# EAGLE design spotmicroservo (EAGLE 9.6.2)
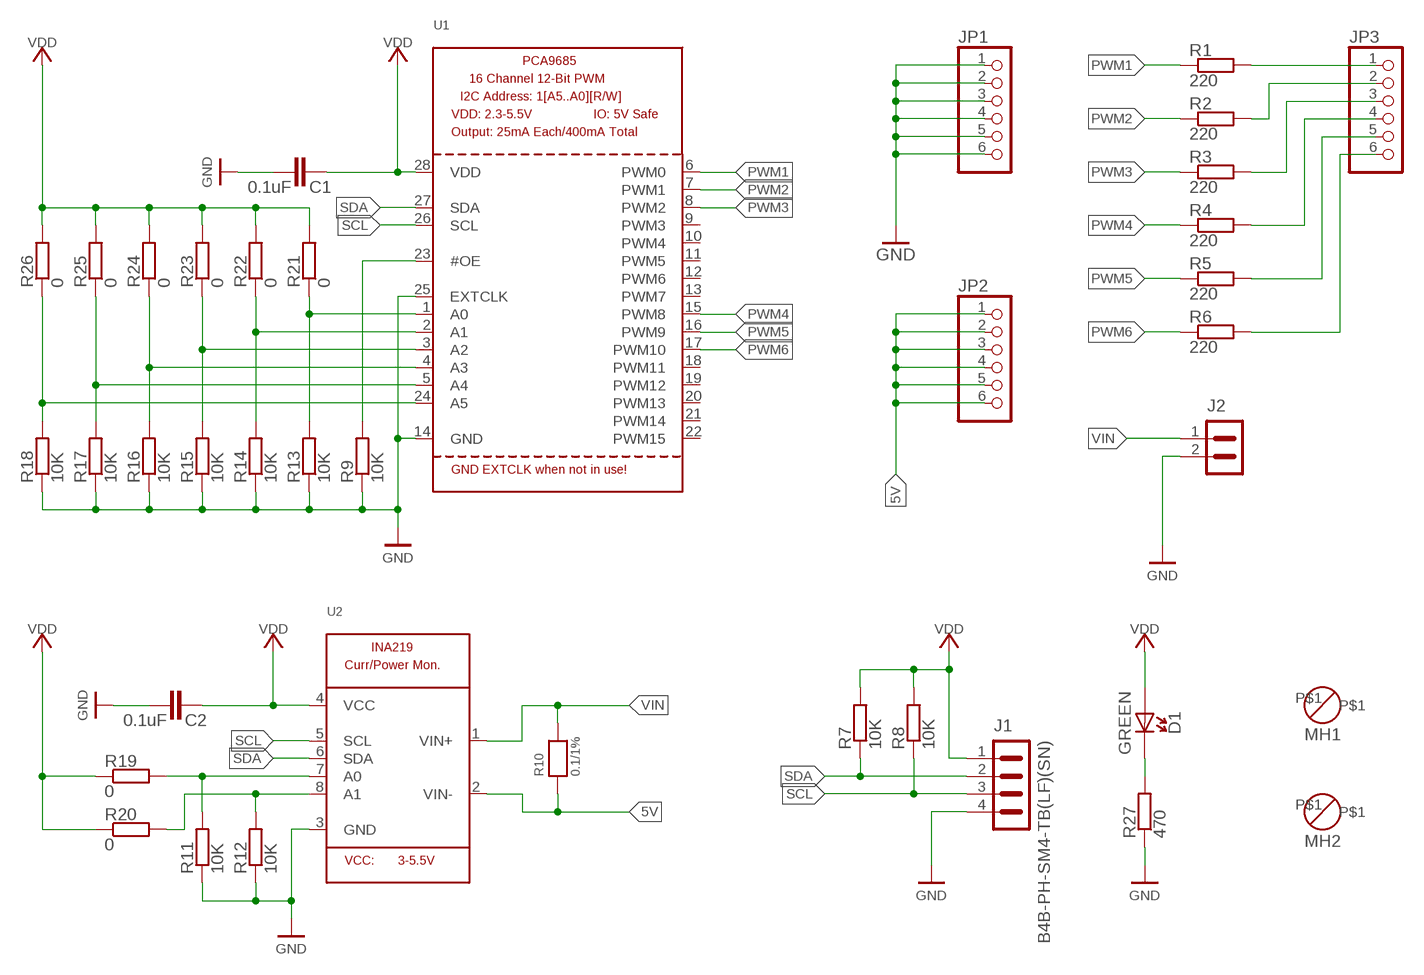
[diagram p0: schematic, sheet 1]

## Parts
C1  0.1uF  CAPACITOR_NPOL-0402  [C0402]
C2  0.1uF  CAPACITOR_NPOL-0402  [C0402]
D1  GREEN  LED_SINGLE-0402  [D0402]
J1  B4B-PH-SM4-TB(LF)(SN)  CON_HEADER_1X04_JST_B4B-PH-SM4-TB(LF)(SN)  [CON_JST_B4B-PH-SM4-TB(LF)(SN)]
J2  CON_HEADER_1X02-B2B-XH-A(LF)(SN)  [JST_B2B-XH-A(LF)(SN)]
JP1  PINHD-1X6B  [1X06-BIG]
JP2  PINHD-1X6B  [1X06-BIG]
JP3  PINHD-1X6B  [1X06-BIG]
MH1  MOUNT-HOLE2.6MM  [MOUNT-HOLE2.6]
MH2  MOUNT-HOLE2.6MM  [MOUNT-HOLE2.6]
R1  220  RESISTOR-0402  [R0402]
R2  220  RESISTOR-0402  [R0402]
R3  220  RESISTOR-0402  [R0402]
R4  220  RESISTOR-0402  [R0402]
R5  220  RESISTOR-0402  [R0402]
R6  220  RESISTOR-0402  [R0402]
R7  10K  RESISTOR-0402  [R0402]
R8  10K  RESISTOR-0402  [R0402]
R9  10K  RESISTOR-0402  [R0402]
R10  0.1/1%  MICROBUILDER_RESISTOR2512  [MICROBUILDER_2512]
R11  10K  RESISTOR-0402  [R0402]
R12  10K  RESISTOR-0402  [R0402]
R13  10K  RESISTOR-0402  [R0402]
R14  10K  RESISTOR-0402  [R0402]
R15  10K  RESISTOR-0402  [R0402]
R16  10K  RESISTOR-0402  [R0402]
R17  10K  RESISTOR-0402  [R0402]
R18  10K  RESISTOR-0402  [R0402]
R19  0  RESISTOR-0402  [R0402]
R20  0  RESISTOR-0402  [R0402]
R21  0  RESISTOR-0402  [R0402]
R22  0  RESISTOR-0402  [R0402]
R23  0  RESISTOR-0402  [R0402]
R24  0  RESISTOR-0402  [R0402]
R25  0  RESISTOR-0402  [R0402]
R26  0  RESISTOR-0402  [R0402]
R27  470  RESISTOR-0402  [R0402]
U1  PCA9685  [TSSOP28]
U2  MICROBUILDER_INA219  [MICROBUILDER_SOT23-8]

## Nets
5V: JP2.1 JP2.2 JP2.3 JP2.4 JP2.5 JP2.6 R10.1 U2.2(VIN-)
GND: C1.1 C2.1 J1.4 J2.2 JP1.1 JP1.2 JP1.3 JP1.4 JP1.5 JP1.6 R9.1 R11.1 R12.1 R13.1 R14.1 R15.1 R16.1 R17.1 R18.1 R27.1 U1.14(GND) U1.25(EXTCLK) U2.3(GND)
N$1: JP3.1 R1.2
N$2: R9.2 U1.23(#OE)
N$3: JP3.2 R2.2
N$4: JP3.3 R3.2
N$5: JP3.4 R4.2
N$6: JP3.5 R5.2
N$7: JP3.6 R6.2
N$8: R11.2 R19.2 U2.7(A0)
N$9: R12.2 R20.2 U2.8(A1)
N$10: R13.2 R21.1 U1.1(A0)
N$11: R14.2 R22.1 U1.2(A1)
N$12: R15.2 R23.1 U1.3(A2)
N$13: R16.2 R24.1 U1.4(A3)
N$14: R17.2 R25.1 U1.5(A4)
N$15: R18.2 R26.1 U1.24(A5)
N$16: D1.2(C) R27.2
PWM1: R1.1 U1.6(PWM0)
PWM2: R2.1 U1.7(PWM1)
PWM3: R3.1 U1.8(PWM2)
PWM4: R4.1 U1.15(PWM8)
PWM5: R5.1 U1.16(PWM9)
PWM6: R6.1 U1.17(PWM10)
SCL: J1.3 R8.1 U1.26(SCL) U2.5(SCL)
SDA: J1.2 R7.1 U1.27(SDA) U2.6(SDA)
VDD: C1.2 C2.2 D1.1(A) J1.1 R7.2 R8.2 R19.1 R20.1 R21.2 R22.2 R23.2 R24.2 R25.2 R26.2 U1.28(VDD) U2.4(VCC)
VIN: J2.1 R10.2 U2.1(VIN+)
Unconnected: MH1.P$1 MH2.P$1 U1.9(PWM3) U1.10(PWM4) U1.11(PWM5) U1.12(PWM6) U1.13(PWM7) U1.18(PWM11) U1.19(PWM12) U1.20(PWM13) U1.21(PWM14) U1.22(PWM15)

## Library data of the parts
C1 C2 = carro:CAPACITOR_NPOL: Non-Polarized capacitor in various packages
D1 = carro:LED_SINGLE
J1 = carro:CON_HEADER_1X04
J2 = carro:CON_HEADER_1X02
JP1-JP3 = adafruit:PINHD-1X6: PIN HEADER
MH1 MH2 = carro:MOUNT-HOLE; BOM: EXCLUDE
R1-R9 R11-R27 = carro:RESISTOR: Resistor in various packages
R10 = Adafruit_INA219_CurPowerMonitor:MICROBUILDER_RESISTOR: Resistors 0402 - 0402 Surface Mount Package 22 Ohm 1% 1/16W [Digikey: 311-22.0LRTR-ND] 33 Ohm 5% 1/16W 1.0K 5% 1/16W 1.5K 5% 1/16W 2.0K 1% 1/16W 10.0K 1% 1/16W [Digikey: 311-10.0KLRTR-ND] 10.0K 5% 1/16W [Digikey: RMCF0402JT10K0TR-ND] 12.1K 1% 1/16W [Digikey: 311-22.0LRTR-ND] 100.0K 5% 1/16W 0603 - 0603 Surface Mount Package 0 Ohm 1/10 Watt 1% Resistor 15 Ohm 1/10 Watt 1% Resistor 33 Ohm 1/10 Watt 1% Resistor 49.9 Ohm 1/10 Watt 1% Resistor 100 Ohm 1/10 Watt 1% Resistor 150 Ohm 1/10 Watt 1% Resistor 240 Ohm 1/10 Watt 1% Resistor 390 Ohm 1/10 Watt 1% Resistor 560 Ohm 1/10 Watt 1% Resistor 680 Ohm 1/10 Watt 1% Resistor 750 Ohm 1/10 Watt 1% Resistor 1.0K Ohm 1/10 Watt 1% Resistor 1.5K Ohm 1/10 Watt 1% Resistor 2.0K Ohm 1/10 Watt 1% Resistor 2.2K Ohm 1/10 Watt 1% Resistor 3.3K Ohm 1/10 Watt 1% Resistor 4.7K Ohm 1/10 Watt 1% Resistor 10.0K Ohm 1/10 Watt 1% Resistor 12.0K Ohm 1/10 Watt 1% Resistor 12.1K Ohm 1/10 Watt 1% Resistor 20.0K Ohm 1/10 Watt 1% Resistor 33.0K Ohm 1/10 Watt 1% Resistor 100.0K Ohm 1/10 Watt 1% Resistor 0805 - 0805 Surface Mount Package 0 Ohm 1/8 Watt 1% Resistor 33 Ohm 1/8 Watt 1% Resistor 100 Ohm 1/8 Watt 1% Resistor 150 Ohm 1/8 Watt 1% Resistor 200 Ohm 1/8 Watt 1% Resistor 240 Ohm 1/8 Watt 1% Resistor 330 Ohm 1/8 Watt 1% Resistor 390 Ohm 1/8 Watt 1% Resistor 470 Ohm 1/8 Watt 1% Resistor 1.0K Ohm 1/8 Watt 1% Resistor 1.5K Ohm 1/8 Watt 1% Resistor 2.0K Ohm 1/8 Watt 1% Resistor 4.7K Ohm 1/8 Watt 1% Resistor 5.1K Ohm 1/8 Watt 1% Resistor 5.6K Ohm 1/8 Watt 1% Resistor 10.0K Ohm 1/8 Watt 1% Resistor 22.0K Ohm 1/8 Watt 1% Resistor 33.0K Ohm 1/8 Watt 1% Resistor 100K Ohm 1/8 Watt 1% Resistor 1206 - 1206 Surface Mount Package 2012 - 2010 Surface Mount Package 0.11 Ohm 1/2 Watt 1% Resistor - Digikey: RHM.11UCT-ND
U1 = adafruit:PCA9685: PCA9685 - 16 Channel 12-Bit I2C PWM Controller 5.0V tolerant 16 channel, 12-bit I2C PWM controller with 25mA per output (max. 400mA total) Digikey: 568-5931-1-ND
U2 = Adafruit_INA219_CurPowerMonitor:MICROBUILDER_INA219: INA219 - I2C Current/Power Monitor Voltage Range: 0-26V Accuracy: 0.5% Temperature: -40°C - 125°C

## Board
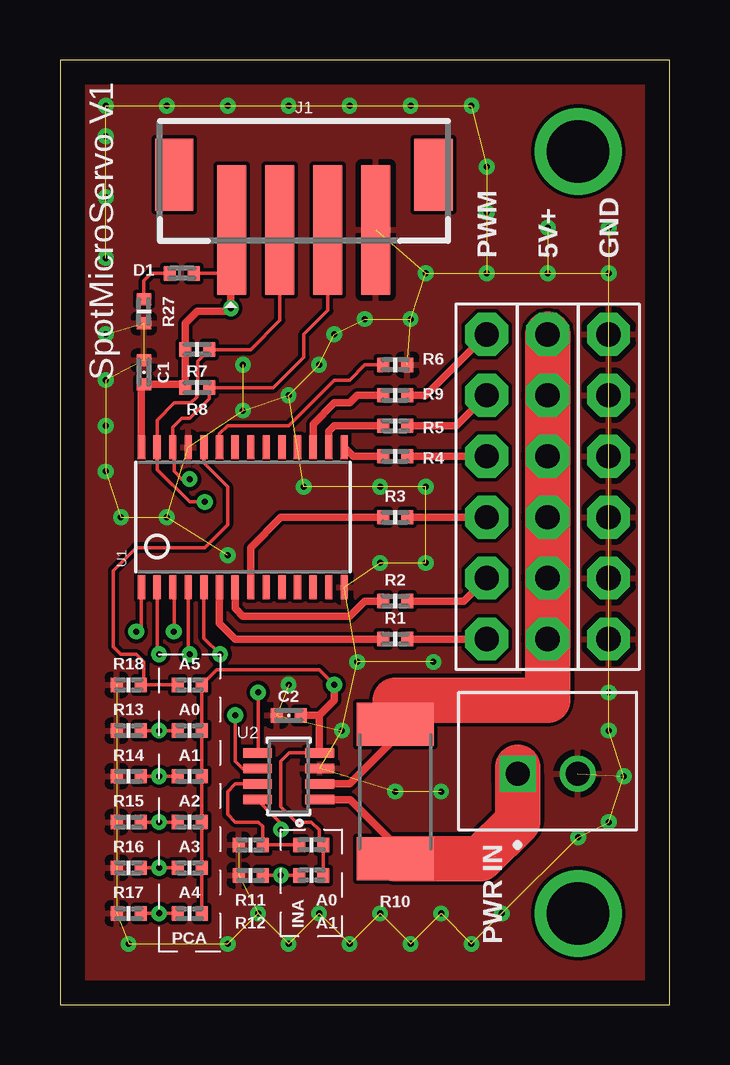
[diagram p1: board, top side]
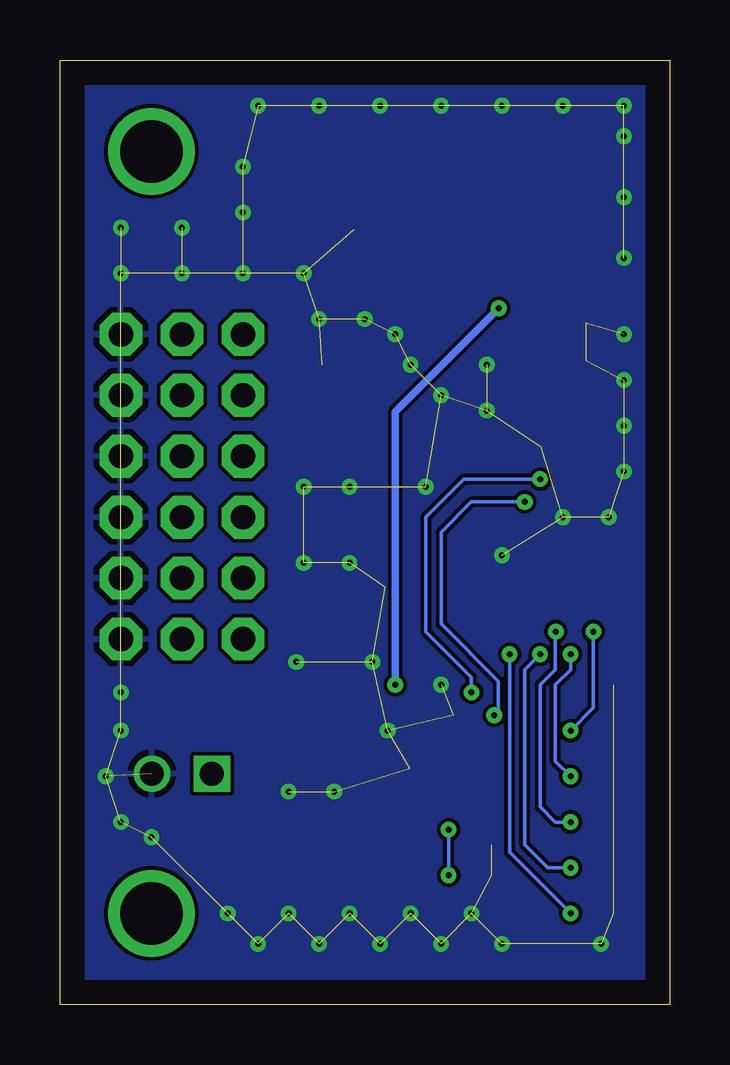
[diagram p2: board, bottom side, seen from below]

Size 25.4 x 39.37 mm. Coordinates in mm from the lower left corner, seen from the top.
Outline: 0,0 25.4,0 25.4,39.37 0,39.37 0,0
Copper layers (1*16): Top 0.035mm / dielectric 1.5mm / Bottom 0.035mm
Design rules "default": minimum track width 6mil, minimum drill 0.35mm, track to track 6mil, track to pad 6mil, pad to pad 6mil, via to via 6mil, smd to smd 6mil, copper to edge 40mil, drill to drill 6mil, minimum pad ring 10mil, minimum via ring 8mil, stop-mask expansion 4mil, vias tented up to drill 0mil, thermal gap 10mil

### Footprints (pad centres in the part's own frame; a part is rotated, then mirrored left to right if it is on the bottom)
C0402 = smd 0.5 x 0.6: 1 -0.5,0; 2 0.5,0
D0402 = smd 0.5 x 0.6: 1 -0.5,0; 2 0.5,0
CON_JST_B4B-PH-SM4-TB(LF)(SN) = smd 1.2 x 5.4: 1 -3,-1.05; 2 -1,-1.05; 3 1,-1.05; 4 3,-1.05 | smd 1.6 x 3: NC@1 -5.4,1.25; NC@2 5.4,1.25
JST_B2B-XH-A(LF)(SN) = drill 1 square: 1 -1.25,-0.525 | drill 1: 2 1.25,-0.525
1X06-BIG = drill 1.016 pad 1.778 octagon: 1 -6.35,0; 2 -3.81,0; 3 -1.27,0; 4 1.27,0; 5 3.81,0; 6 6.35,0
MOUNT-HOLE2.6 = drill 2.6 pad 3.6: P$1 0,0
R0402 = smd 0.5 x 0.6: 1 -0.5,0; 2 0.5,0
MICROBUILDER_2512 = smd 1.8 x 3.2: 1 -2.8,0; 2 2.8,0
TSSOP28 = smd 0.305 x 0.991: 1 -4.225,-2.918; 2 -3.575,-2.918; 3 -2.925,-2.918; 4 -2.275,-2.918; 5 -1.625,-2.918; 6 -0.975,-2.918; 7 -0.325,-2.918; 8 0.325,-2.918; 9 0.975,-2.918; 10 1.625,-2.918; 11 2.275,-2.918; 12 2.925,-2.918; 13 3.575,-2.918; 14 4.225,-2.918; 15 4.225,2.918; 16 3.575,2.918; 17 2.925,2.918; 18 2.275,2.918; 19 1.625,2.918; 20 0.975,2.918; 21 0.325,2.918; 22 -0.325,2.918; 23 -0.975,2.918; 24 -1.625,2.918; 25 -2.275,2.918; 26 -2.925,2.918; 27 -3.575,2.918; 28 -4.225,2.918
MICROBUILDER_SOT23-8 = smd 0.4 x 1.2: 1 -0.975,-1.3; 2 -0.325,-1.3; 3 0.325,-1.3; 4 0.975,-1.3; 5 0.975,1.3; 6 0.325,1.3; 7 -0.325,1.3; 8 -0.975,1.3

### Placement (x,y rotation side)
C1  3.49,26.35 270 top
C2  9.53,12.06 0 top
D1  5.08,30.48 180 top
J1  10.16,33.34 0 top
J2  20.32,10.16 0 top
JP1  22.86,21.59 90 top
JP2  20.32,21.59 90 top
JP3  17.78,21.59 90 top
MH1  21.59,3.81 0 top
MH2  21.59,35.56 0 top
R1  13.97,15.24 0 top
R2  13.97,16.83 0 top
R3  13.97,20.32 0 top
R4  13.97,22.86 0 top
R5  13.97,24.13 0 top
R6  13.97,25.4 0 top
R7  5.72,27.3 180 top
R8  5.72,25.72 180 top
R9  13.97,26.67 180 top
R10  13.97,8.89 270 top
R11  7.94,6.67 0 top
R12  7.94,5.4 0 top
R13  2.86,11.43 0 top
R14  2.86,9.52 0 top
R15  2.86,7.62 0 top
R16  2.86,5.71 0 top
R17  2.86,3.81 0 top
R18  2.86,13.34 0 top
R19  10.48,6.67 180 top
R20  10.48,5.4 180 top
R21  5.4,11.43 0 top
R22  5.4,9.52 0 top
R23  5.4,7.62 0 top
R24  5.4,5.71 0 top
R25  5.4,3.81 0 top
R26  5.4,13.34 0 top
R27  3.49,28.89 90 top
U1  7.62,20.32 0 top
U2  9.53,9.52 90 top

### Tracks (layer width: path | path; a pad name or v marks a point on that pad's centre or on a via)
5V
  Top 0.305: U2.2 10.83,9.21 12.07,9.21 13.97,11.11 R10.1
  Top 0.61: 13.97,12.7 R10.1
  Top 1.905: JP2.6 JP2.5 JP2.4 JP2.3 JP2.2 JP2.1 20.32,12.7 13.97,12.7
GND  (via drill 0.25)  (81 unrouted)
  other vias: 4.45,20.32 2.54,20.32 1.91,22.23 1.91,24.13 7.62,24.77 9.53,25.4 10.8,26.67 7.62,26.67 11.43,27.94 12.7,28.58 14.61,28.58 15.24,30.48 17.78,30.48 20.32,30.48 22.86,30.48 10.16,21.59 13.34,21.59 15.24,21.59 13.34,18.41 15.24,18.41 13.97,8.89 15.88,8.89 22.86,11.43 23.5,9.52 22.86,7.62 18.42,3.81 15.88,3.81 13.34,3.81 10.8,3.81 8.26,3.81 1.91,26.03 1.91,27.94 1.91,31.11 1.91,33.66 1.91,36.19 1.91,37.47 4.45,37.47 6.99,37.47 9.53,37.47 12.07,37.47 14.61,37.47 17.15,37.47 17.78,34.92 17.78,33.02 20.32,32.39 22.86,32.39 17.15,2.54 14.61,2.54 12.07,2.54 9.53,2.54 6.99,2.54 2.86,2.54 12.38,14.29 15.56,14.29 21.59,6.98 6.99,18.73 22.86,13.02 9.53,13.34 11.75,11.43
  pour Top: -2.54,41.91 27.94,41.91 27.94,-2.54 -2.54,-2.54
  pour Bottom: -5.08,44.45 30.48,44.45 30.48,-5.08 -5.08,-5.08
N$1
  Top 0.305: R1.2 JP3.1
N$2
  Top 0.152: U1.23 6.65,23.79 6.99,24.13 9.53,24.13 11.43,26.03 12.07,26.03 12.7,26.67 R9.2
N$3
  Top 0.305: JP3.2 16.83,16.83 R2.2
N$4
  Top 0.305: R3.2 JP3.3
N$5
  Top 0.305: R4.2 JP3.4
N$6
  Top 0.305: R5.2 16.51,24.13 JP3.5
N$7
  Top 0.305: JP3.6 15.24,25.4 R6.2
N$8
  Top 0.152: R19.2 R11.2 8.44,7.44 8.26,7.62 7.3,7.62 6.99,7.94 6.99,8.89 7.3,9.21 8.22,9.21 U2.7
N$9  (via drill 0.25)
  Top 0.152: R20.2 v9.21,5.4 R12.2 | v9.21,7.3 9.21,7.57 U2.8
  Bottom 0.152: v9.21,5.4 v9.21,7.3
N$10  (via drill 0.25)
  Top 0.152: R13.2 v4.13,11.43 R21.1 | v3.18,15.56 3.4,15.78 U1.1
  Bottom 0.152: v4.13,11.43 3.18,12.38 v3.18,15.56
N$11  (via drill 0.25)
  Top 0.152: R14.2 v4.13,9.52 R22.1 | U1.2 4.05,14.69 v4.13,14.6
  Bottom 0.152: v4.13,9.52 4.76,10.16 4.76,13.34 4.13,13.97 v4.13,14.6
N$12  (via drill 0.25)
  Top 0.152: R15.2 v4.13,7.62 R23.1 | U1.3 4.76,17.34 4.76,15.56 v4.74,15.56
  Bottom 0.152: v4.13,7.62 4.76,7.62 5.4,8.26 5.4,13.34 4.76,13.97 4.76,15.53 v4.74,15.56
N$13  (via drill 0.25)
  Top 0.152: R16.2 v4.13,5.71 R24.1 | v5.4,14.6 5.35,14.66 U1.4
  Bottom 0.152: v4.13,5.71 5.08,5.71 6.03,6.67 6.03,13.97 v5.4,14.6
N$14  (via drill 0.25)
  Top 0.152: R17.2 v4.13,3.81 R25.1 | v6.67,14.6 6,15.28 U1.5
  Bottom 0.152: v4.13,3.81 6.67,6.35 v6.67,14.6
N$15
  Top 0.152: R18.2 3.49,13.34 | 3.49,13.34 R26.1 | U1.24 6,22.58 6.99,21.59 6.99,20 6.03,19.05 3.18,19.05 2.22,18.1 2.22,14.92 2.54,14.6 3.18,14.6 3.49,14.29 3.49,13.34
N$16
  Top 0.152: D1.2 3.81,30.48 3.49,30.16 R27.2
PWM1
  Top 0.305: R1.1 7.3,15.24 6.65,15.9 U1.6
PWM2
  Top 0.305: U1.7 7.3,16.52 7.62,16.19 12.07,16.19 12.7,16.83 R2.1
PWM3
  Top 0.305: R3.1 9.21,20.32 7.94,19.05 7.94,17.41 U1.8
PWM4
  Top 0.305: R4.1 12.22,22.86 U1.15
PWM5
  Top 0.305: U1.16 11.2,23.89 11.43,24.13 R5.1
PWM6
  Top 0.305: R6.1 12.38,25.4 12.07,25.08 11.43,25.08 10.55,24.2 U1.17
SCL  (via drill 0.25)
  Top 0.152: J1.3 11.16,28.94 10.16,27.94 10.16,26.99 8.89,25.72 R8.1 6.22,25.27 5.4,24.45 5.08,24.45 4.7,24.06 U1.26 4.76,23.17 4.76,22.23 5.08,21.91 v5.4,21.91 | v8.26,13.02 8.26,10.53 U2.5
  Bottom 0.152: v5.4,21.91 8.57,21.91 10.16,20.32 10.16,15.56 8.26,13.65 v8.26,13.02
SDA  (via drill 0.25)
  Top 0.152: U1.27 4.05,24.36 4.76,25.08 5.45,25.08 5.69,25.32 5.69,25.38 5.74,25.42 5.74,26.83 R7.1 7.94,27.3 9.16,28.53 J1.2 | U1.27 4.13,23.16 | U2.6 8.22,9.84 7.62,9.84 7.3,10.16 v7.3,12.06 | v6.03,20.95 5.4,20.95 4.05,22.31 U1.27
  Bottom 0.152: v6.03,20.95 8.26,20.95 9.53,19.69 9.53,15.88 7.14,13.49 7.14,12.22 v7.3,12.06
VDD  (via drill 0.25)
  Top 0.152: R20.1 R19.1 | R19.1 10.98,6.8 | R25.2 R24.2 R23.2 R22.2 R21.2 R26.2 6.53,13.97 10.8,13.97 v11.43,13.34 | R19.1 10.8,6.85 10.8,7.3 10.48,7.62 9.84,7.62 9.21,8.26 9.21,10.16 9.55,10.5 U2.4 | D1.1 7.12,30.48
  Top 0.305: J1.1 7.16,30.66 7.12,30.61 7.12,30.48 v7.12,29.03 6.99,28.89 5.72,28.89 5.22,28.39 R7.2 R8.2 5.08,25.85 C1.2 3.4,25.75 U1.28 | v11.43,13.34 11.43,12.7 10.8,12.06 | 10.8,12.06 C2.2 | U2.4 10.8,10.53 10.8,12.06
  Bottom 0.305: v7.12,29.03 11.43,24.72 v11.43,13.34
VIN
  Top 0.305: U2.1 12.09,8.55 13.97,6.67 R10.2
  Top 1.27: J2.1 19.07,9.4
  Top 1.905: J2.1 19.07,9.4 | 19.07,9.4 19.07,7.64 17.52,6.09 R10.2 | 19.07,9.4 19.07,9.91

### Text on the board
tNames: PWM | 5V+ | GND | SpotMicroServo V1 | A5 | A0 | A1 | A2 | A3 | A4 | A0 | INA | A1 | PCA | PWR IN